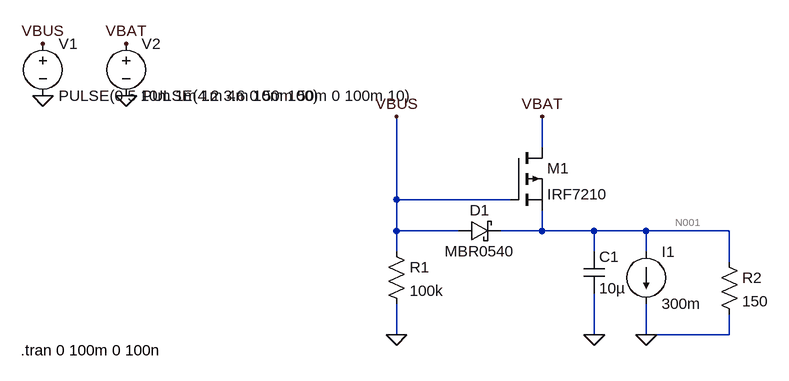
[diagram p0: schematic BatterySwitch.asc]
BatterySwitch.asc, the LTspice schematic file:
Version 4
SHEET 1 880 680
WIRE 384 32 384 -16
WIRE 160 112 160 -16
WIRE 336 112 160 112
WIRE 160 160 160 112
WIRE 256 160 160 160
WIRE 384 160 384 128
WIRE 384 160 320 160
WIRE 464 160 384 160
WIRE 544 160 464 160
WIRE 672 160 544 160
WIRE 160 192 160 160
WIRE 464 192 464 160
WIRE 544 192 544 160
WIRE 672 208 672 160
WIRE 160 320 160 272
WIRE 464 320 464 256
WIRE 544 320 544 272
WIRE 672 320 672 288
WIRE 672 320 544 320
FLAG -384 -48 0
FLAG -256 -48 0
FLAG -384 -128 VBUS
FLAG -256 -128 VBAT
FLAG 160 320 0
FLAG 544 320 0
FLAG 160 -16 VBUS
FLAG 464 320 0
FLAG 384 -16 VBAT
SYMBOL pmos 336 32 R0
SYMATTR InstName M1
SYMATTR Value IRF7210
SYMBOL voltage -384 -144 R0
WINDOW 123 0 0 Left 0
WINDOW 39 24 44 Left 2
SYMATTR InstName V1
SYMATTR Value PULSE(0 5 10m 1m 1m 4m 10m 100)
SYMBOL voltage -256 -144 R0
WINDOW 123 0 0 Left 0
WINDOW 39 24 44 Left 2
SYMATTR InstName V2
SYMATTR Value PULSE(4.2 3.6 0 50m 50m 0 100m 10)
SYMBOL res 144 176 R0
SYMATTR InstName R1
SYMATTR Value 100k
SYMBOL cap 448 192 R0
SYMATTR InstName C1
SYMATTR Value 10µ
SYMATTR SpiceLine Rser=1
SYMBOL schottky 256 176 R270
WINDOW 0 32 32 VTop 2
WINDOW 3 0 32 VBottom 2
SYMATTR InstName D1
SYMATTR Value MBR0540
SYMBOL current 544 192 R0
WINDOW 123 0 0 Left 0
WINDOW 39 0 0 Left 0
SYMATTR InstName I1
SYMATTR Value 300m
SYMBOL res 656 192 R0
SYMATTR InstName R2
SYMATTR Value 150
TEXT -418 344 Left 2 !.tran 0 100m 0 100n

The netlist it stands for:
* BatterySwitch.asc
M1 VBAT VBUS N001 N001 IRF7210
V1 VBUS 0 PULSE(0 5 10m 1m 1m 4m 10m 100)
V2 VBAT 0 PULSE(4.2 3.6 0 50m 50m 0 100m 10)
R1 VBUS 0 100k
C1 N001 0 10µ Rser=1
D1 VBUS N001 MBR0540
I1 N001 0 300m
R2 N001 0 150
.model D D
.lib standard.dio
.model NMOS NMOS
.model PMOS PMOS
.lib standard.mos
.tran 0 100m 0 100n
.backanno
.end

* Results of the author's LTspice run, read from the files saved beside the schematic
* Operating Point, zero values left out:
*   V(vbat) = 4.2 V
*   V(n001) = 4.198 V
*   Id(M1) = 328 mA
*   Is(M1) = -328 mA
*   I(D1) = -9.11 µA
*   I(I1) = 300 mA
*   I(R2) = 27.99 mA
*   I(V2) = -328 mA
*   I(V1) = 9.11 µA
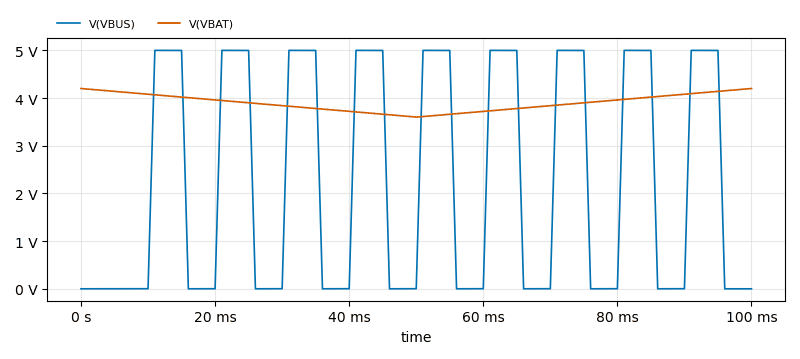
[diagram p1: Transient Analysis of BatterySwitch.asc, plotted from the saved traces]
* Transient Analysis, 1 run:
*   V(VBUS): min 0 V, max 5 V, average 2.25 V, rms 3.24 V, last 0 V
*   V(VBAT): min 3.6 V, max 4.2 V, average 3.9 V, rms 3.904 V, last 4.2 V